# EAGLE design mister_io_todb9 (EAGLE 9.0.0)
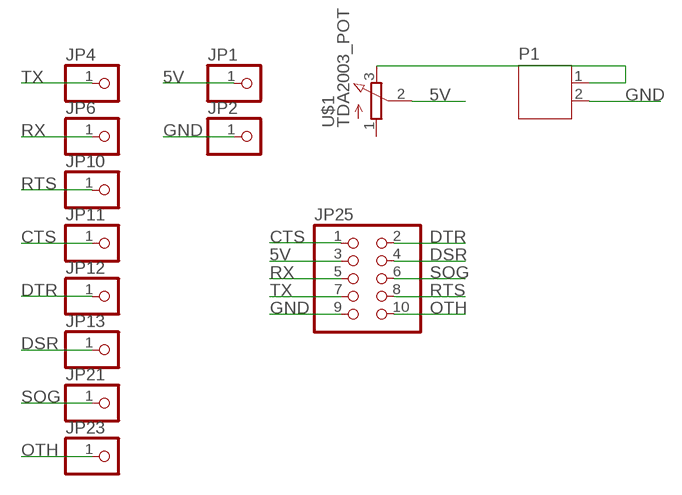
[diagram p0: schematic, sheet 1]

## Parts
JP1  PINHD-1X1  [1X01]
JP2  PINHD-1X1  [1X01]
JP4  PINHD-1X1  [1X01]
JP6  PINHD-1X1  [1X01]
JP10  PINHD-1X1  [1X01]
JP11  PINHD-1X1  [1X01]
JP12  PINHD-1X1  [1X01]
JP13  PINHD-1X1  [1X01]
JP21  PINHD-1X1  [1X01]
JP23  PINHD-1X1  [1X01]
JP25  PINHD-2X5  [2X05]
P1  JST-PH2  [JST-PH2]
U$1  TDA2003_POT  [TDA2003_POT]

## Nets
5V: JP1.1 JP25.3 U$1.2(S)
CTS: JP11.1 JP25.1
DSR: JP13.1 JP25.4
DTR: JP12.1 JP25.2
GND [power]: JP2.1 JP25.9 P1.2
N$8: P1.1 U$1.3(E)
OTH: JP23.1 JP25.10
RTS: JP10.1 JP25.8
RX: JP6.1 JP25.5
SOG: JP21.1 JP25.6
TX: JP4.1 JP25.7
Unconnected: U$1.1(A)

## Library data of the parts
JP1 JP2 JP4 JP6 JP10-JP13 JP21 JP23 = pinhead:PINHD-1X1: PIN HEADER
JP25 = pinhead:PINHD-2X5: PIN HEADER
P1 = jst-ph:JST-PH2
U$1 = mister_io_todb9:TDA2003_POT

## Net classes
0 default: width 0.178 mm, clearance 0.178 mm
1 power: width 0.305 mm, clearance 0.178 mm to class 0, clearance 0.229 mm

## Board
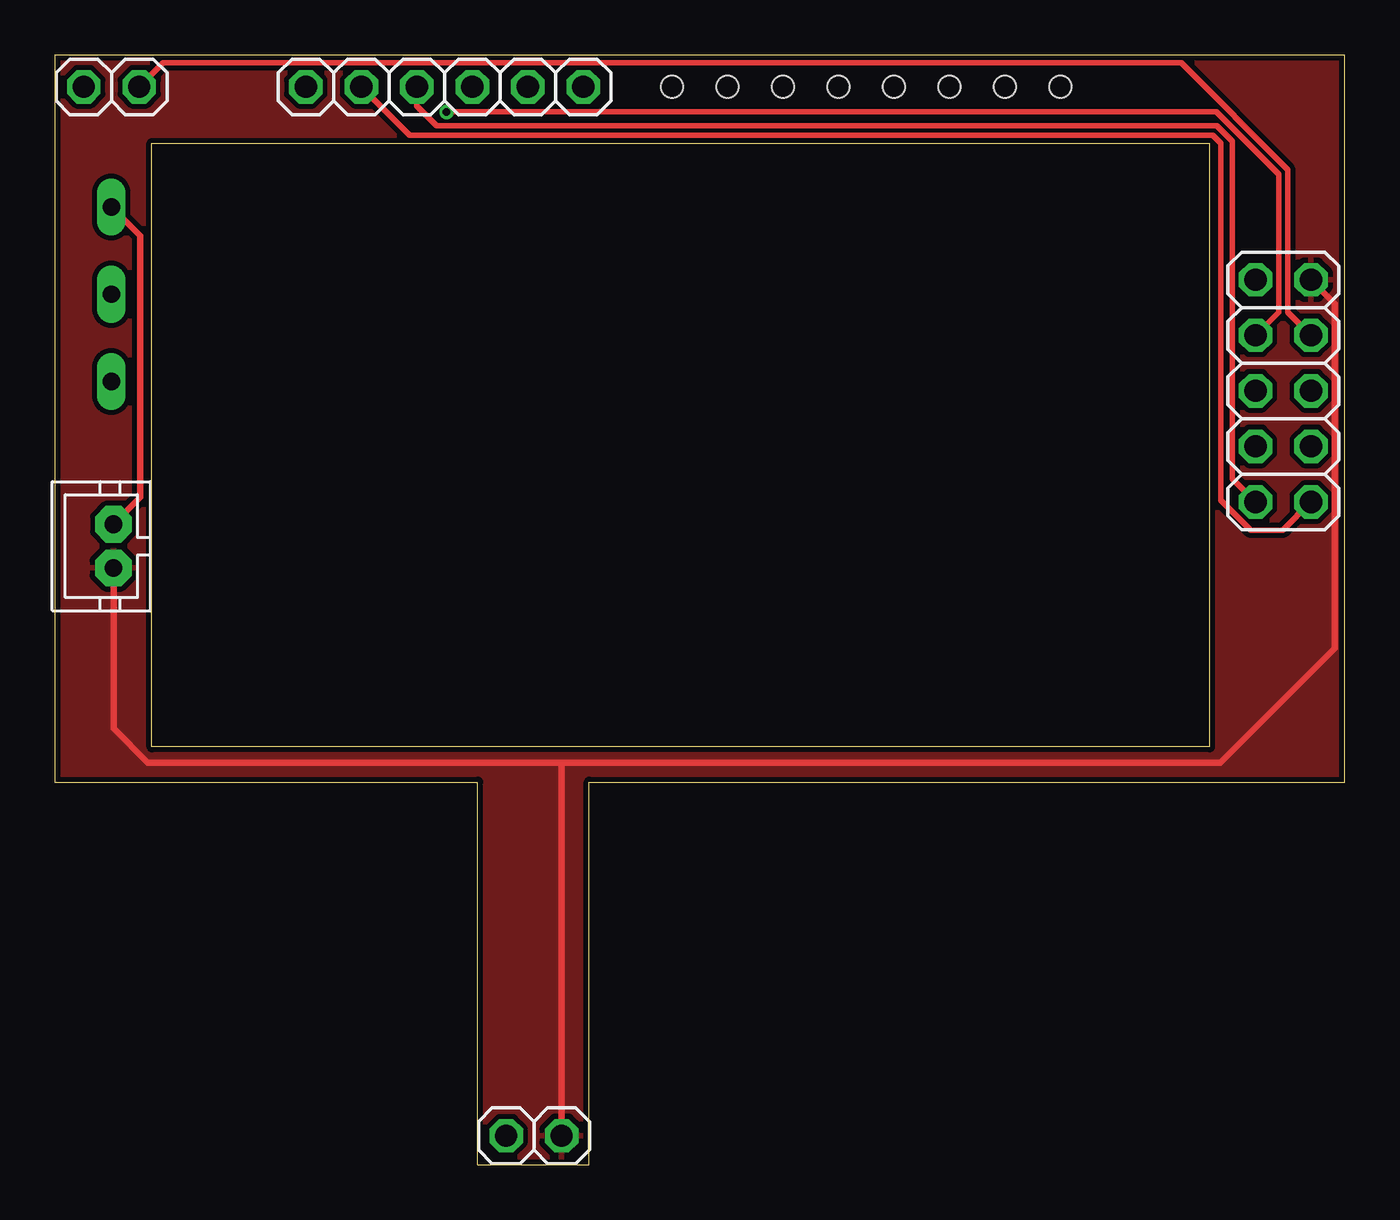
[diagram p1: board, top side]
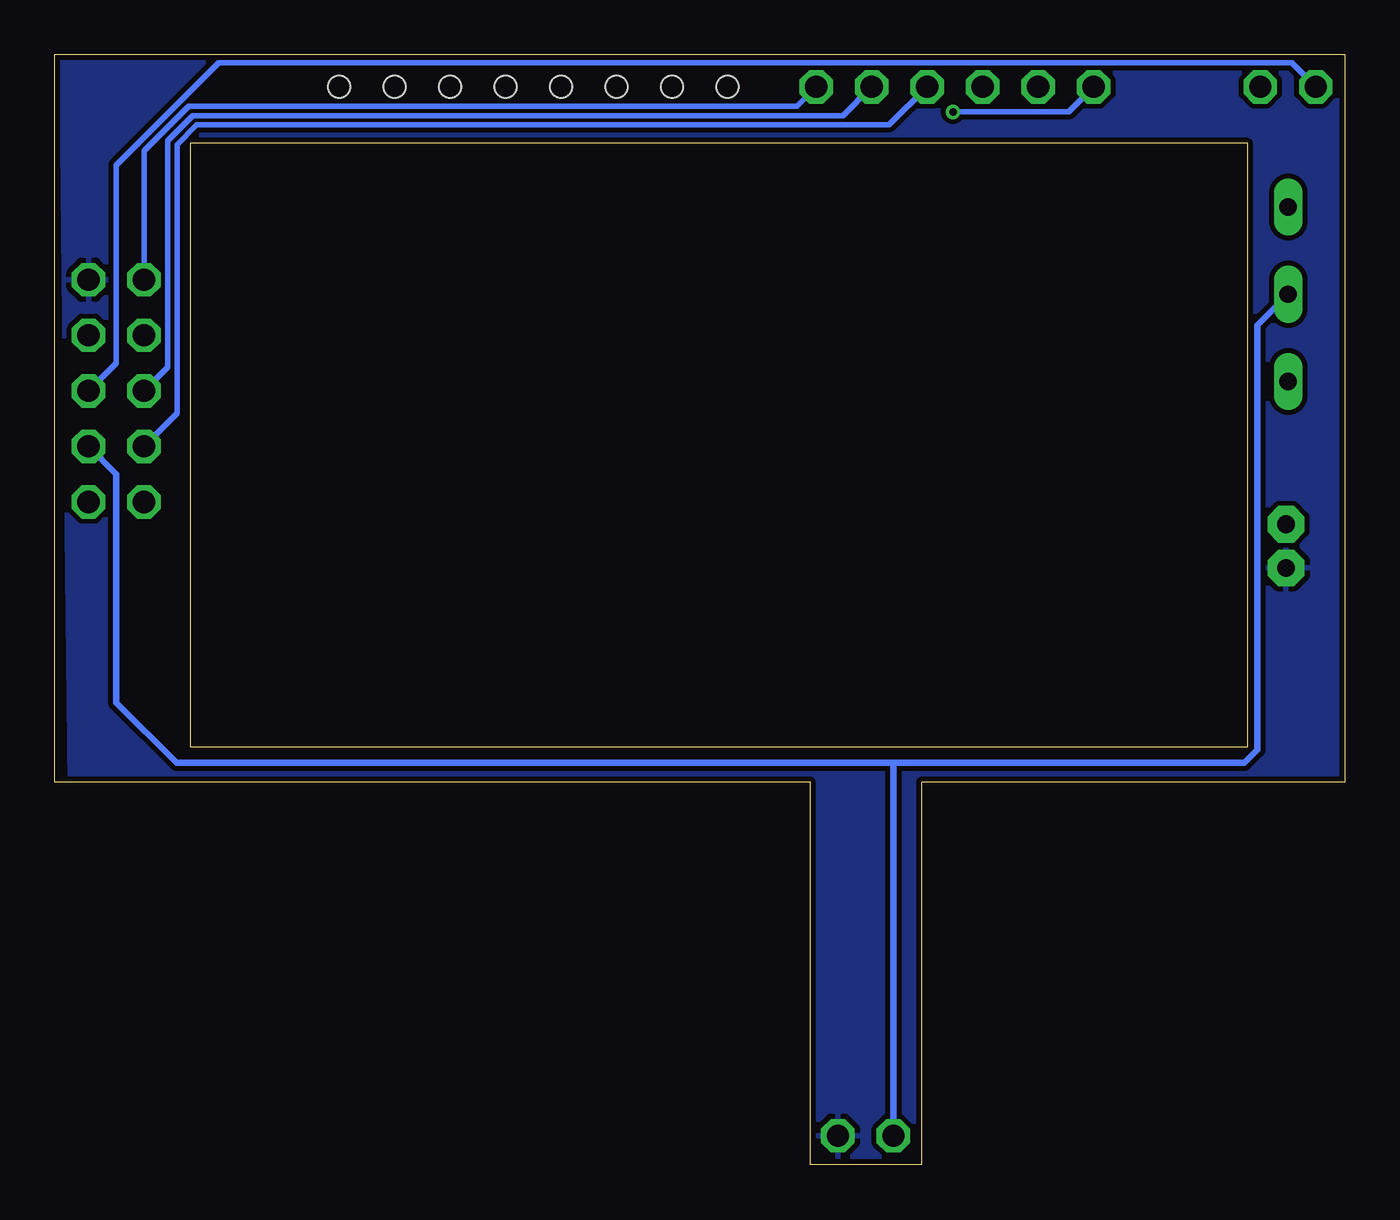
[diagram p2: board, bottom side, seen from below]

Size 59.04 x 50.79 mm. Coordinates in mm from the lower left corner, seen from the top.
Outline: 59.04,17.51 59.04,50.79 0,50.79 0,17.51 19.35,17.51 19.35,0 24.46,0 24.46,17.51 59.04,17.51
Outline: 52.84,46.72 52.84,19.13 4.44,19.13 4.44,46.72 52.84,46.72
Copper layers (1*16): Top 0.035mm / dielectric 1.5mm / Bottom 0.035mm
Design rules "seedstudio_Fusion_eagle_rule_v1.1": minimum track width 6mil, minimum drill 12mil, track to track 6mil, track to pad 6mil, pad to pad 6mil, via to via 6mil, smd to smd 0mil, copper to edge 10mil, drill to drill 10mil, minimum pad ring 10mil, minimum via ring 6mil, stop-mask expansion 2mil, vias tented up to drill 100mil, thermal gap 10mil
Holes 1 mm at 28.25,49.31 30.79,49.31 33.33,49.31 35.87,49.31 46.03,49.31 38.41,49.31 40.95,49.31 43.49,49.31

### Footprints (pad centres in the part's own frame; a part is rotated, then mirrored left to right if it is on the bottom)
1X01 = drill 1.016 octagon: 1 0,0
2X05 = drill 1.016 octagon: 1 -5.08,-1.27; 2 -5.08,1.27; 3 -2.54,-1.27; 4 -2.54,1.27; 5 0,-1.27; 6 0,1.27; 7 2.54,-1.27; 8 2.54,1.27; 9 5.08,-1.27; 10 5.08,1.27
JST-PH2 = drill 0.813 pad 1.676 octagon: 1 1,0; 2 -1,0
TDA2003_POT = drill 0.8 long: 1 -4,0; 2 0,0; 3 4,0

### Placement (x,y rotation side)
JP1  20.66,1.33 0 top
JP2  23.2,1.33 0 top
JP4  3.87,49.31 0 top
JP6  1.33,49.31 0 top
JP10  11.49,49.31 0 top
JP11  14.03,49.31 0 top
JP12  16.57,49.31 0 top
JP13  19.11,49.31 0 top
JP21  21.65,49.31 0 top
JP23  24.19,49.31 0 top
JP25  56.22,35.41 90 top
P1  2.69,28.31 90 top
U$1  2.59,39.83 90 top

### Tracks (layer width: path | path; a pad name or v marks a point on that pad's centre or on a via)
5V
  Bottom 0.305: JP25.3 56.22,31.6 56.22,21.15 53.47,18.39 20.68,18.39 | 20.68,18.39 4.61,18.39 4,19 4,38.42 U$1.2 | 20.68,18.39 20.66,18.38 JP1.1
CTS
  Top 0.254: JP25.1 56.2,29.03 54.74,29.03 53.36,30.41 53.36,46.74 53,47.1 52.63,47.1 52.63,47.11 16.24,47.11 JP11.1
DSR
  Bottom 0.254: JP25.4 53.44,34.38 53.44,46.67 52.54,47.57 20.86,47.57 JP13.1
DTR
  Top 0.254: JP25.2 53.89,31.39 53.89,46.83 53.18,47.54 17.48,47.54 16.57,48.45 JP12.1
GND
  Top 0.305: 53.35,18.4 58.58,23.63 58.58,39.4 JP25.9 | 53.35,18.4 53.34,18.39 | P1.2 2.69,19.96 4.25,18.4 23.25,18.4 | 23.25,18.4 53.35,18.4 | JP2.1 23.2,18.35 23.25,18.4
  pour Bottom: -0.01,-0.15 0.29,50.53 58.72,50.47 58.13,-0.2
  pour Top: 0.3,-0.09 0.24,50.52 58.8,50.47 58.85,0.06
N$8
  Top 0.305: P1.1 3.92,30.54 3.92,42.49 U$1.3
OTH
  Bottom 0.254: JP23.1 25.07,48.43 52.57,48.43 52.9,48.43 54.95,46.38 JP25.10
RTS  (via drill 0.35)
  Top 0.254: JP25.8 56.02,39.01 56.02,45.31 53.16,48.17 v17.93,48.17
  Bottom 0.254: v17.93,48.17 12.64,48.17 JP10.1
RX
  Bottom 0.254: JP6.1 2.43,50.41 51.54,50.41 56.22,45.72 56.22,36.68 JP25.5
SOG
  Bottom 0.254: JP25.6 53.87,36.49 53.87,46.85 52.72,48 22.97,48 JP21.1
TX
  Top 0.254: JP4.1 4.97,50.41 51.55,50.41 56.43,45.53 56.43,39.01 JP25.7